# EAGLE design sensor (EAGLE 9.6.2)
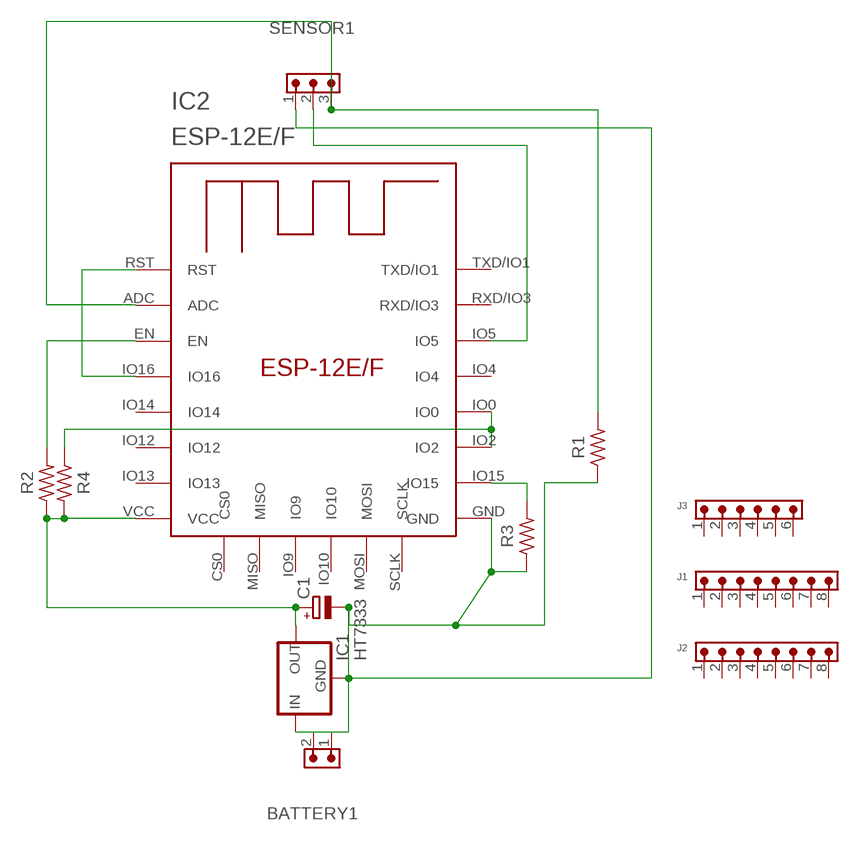
[diagram p0: schematic, sheet 1]

## Parts
BATTERY1  6130XX11121_61300211121  [61300211121]
C1  CPOL-EUE2-5  [E2-5]
IC1  HT7333  [SOT-89]
IC2  ESP-12E/F  [ESP-12E]
J1  6200XX11121_62000811121  [62000811121]
J2  6200XX11121_62000811121  [62000811121]
J3  6200XX11121_62000611121  [62000611121]
R1  R-US_AXIAL-7.2MM-PITCH  [RESAD724W46L381D178B]
R2  R-US_AXIAL-7.2MM-PITCH  [RESAD724W46L381D178B]
R3  R-US_AXIAL-7.2MM-PITCH  [RESAD724W46L381D178B]
R4  R-US_AXIAL-7.2MM-PITCH  [RESAD724W46L381D178B]
SENSOR1  6130XX11121_61300311121  [61300311121]

## Nets
N$1: IC2.IO5 SENSOR1.2
N$2: IC2.IO0 IC2.IO2 R4.1
N$3: IC2.ADC R1.2 SENSOR1.3
N$4: BATTERY1.1 IC1.3(IN) IC1.4(IN)
N$5: IC2.EN R2.2
N$6: IC2.IO16 IC2.RST
N$8: IC2.IO15 R3.2
N$9: BATTERY1.2 C1.- IC1.2(GND) IC2.GND R1.1 R3.1 SENSOR1.1
N$10: C1.+ IC1.1(OUT) IC2.VCC R2.1 R4.2
Unconnected: IC2.CS0 IC2.IO4 IC2.IO9 IC2.IO10 IC2.IO12 IC2.IO13 IC2.IO14 IC2.MISO IC2.MOSI IC2.RXD/IO3 IC2.SCLK IC2.TXD/IO1 J1.1 J1.2 J1.3 J1.4 J1.5 J1.6 J1.7 J1.8 J2.1 J2.2 J2.3 J2.4 J2.5 J2.6 J2.7 J2.8 J3.1 J3.2 J3.3 J3.4 J3.5 J3.6

## Library data of the parts
BATTERY1 = Wurth_Connectors_WR-PHD:6130XX11121_61300211121: WR-PHD 2.54 mm THT Pin Header ARTICLE PROPERTIES: Pins:1;​ 2;​ 3;​ 4;​ 5;​ 6;​ 7;​ 8;​ 9;​ 10;​ 12;​ 13;​ 14;​ 15;​ 16;​ 18;​ 20;​ 22;​ 24;​ 25;​ 32;​ 36;​ 40 KIND PROPERTIES: Pitch：2.54 mm Quality Class:3 as per CECC 75 301-802 Rows：Single Gender：Pin Header Type：Straight MATERIAL PROPERTIES: Insulator Material :PBT Insulator Flammability Rating:UL94 V-0 Contact Material:Copper Alloy Contact Plating:Gold Contact Type:Stamped GENERAL INFORMATION Operating Temperature:-40 up to +105 °C Compliance:RoHS ELECTRICAL PROPERTIES: Rated Current:3 A IR 1:3 A Withstanding Voltage:500 V (AC) Contact Resistance:20 mΩ RISO:1000 MΩ CERTIFICATION UL Approval:E323964 PACKAGING PROPERTIES Packaging:Bag <https://katalog.we-online.com/media/images/v2/o33211v209%20Family_BTB_PHD_6130xx11121.jpg> Details see: https://katalog.we-online.com/en/em/PHD_2_54_THT_PIN_HEADER_6130XX11121 Updated by Yingchun,Shan 2019-10-16 2019 (C) Würth Elektronik; DATASHEET-URL: https://katalog.we-online.com/em/datasheet/61300211121.pdf; GENDER: Pin Header; IR: 3A; MATES: WR-PHD 2.54mm Angled Socket Header /SMT Socket Header/Socket Header; PACKAGING: Bag; PART-NUMBER: 61300211121; PINS: 2; ROWS: Single; TYPE: Straight
C1 = rcl:CPOL-EU: POLARIZED CAPACITOR, European symbol; SPICEPREFIX: C
IC1 = holtek2:HT73*
IC2 = esp-12e-f:ESP-12E/F
J1 J2 = Wurth_Connectors_WR-PHD:6200XX11121_62000811121: WR-PHD 2.00 mm THT Pin Header ARTICLE PROPERTIES: Pins:2;​ 3;​ 4;​ 6;​ 8;​ 10;​ 20;​ 32 KIND PROPERTIES: Pitch：2 mm Quality Class:3 as per CECC 75 301-802 Rows：Single Gender：Pin Header Type：Straight MATERIAL PROPERTIES: Insulator Material :PA9T Insulator Flammability Rating:UL94 V-0 Contact Material:Copper Alloy Contact Plating:Gold Contact Type:Stamped GENERAL INFORMATION Operating Temperature:-40 up to +105 °C Compliance:Lead free / RoHS ELECTRICAL PROPERTIES: Rated Current:max.;​ 2 A IR 1:2A Withstanding Voltage:500 V (AC) Contact Resistance:20 mΩ RISO:1000 MΩ CERTIFICATION UL Approval:E323964 PACKAGING PROPERTIES Packaging:Bag Packaging Unit:1000;​ 500;​ 300;​ 200 <https://katalog.we-online.com/media/images/v2/o33219v209%20Family_WR-PHD_6200xx11121.jpg> Details see: https://katalog.we-online.com/en/em/PHD_2_00_THT_PIN_HEADER_6200XX11121 Updated by Yingchun,Shan 2019-10-24 2019 (C) Würth Elektronik; DATASHEET-URL: https://katalog.we-online.com/em/datasheet/62000811121.pdf; GENDER: Pin Header; IR: 2A; MATES: WR-PHD 2.0mm Socket Header; PACKAGING: Bag; PART-NUMBER: 62000811121; PINS: 8; ROWS: Single; TYPE: Straight
J3 = Wurth_Connectors_WR-PHD:6200XX11121_62000611121: WR-PHD 2.00 mm THT Pin Header ARTICLE PROPERTIES: Pins:2;​ 3;​ 4;​ 6;​ 8;​ 10;​ 20;​ 32 KIND PROPERTIES: Pitch：2 mm Quality Class:3 as per CECC 75 301-802 Rows：Single Gender：Pin Header Type：Straight MATERIAL PROPERTIES: Insulator Material :PA9T Insulator Flammability Rating:UL94 V-0 Contact Material:Copper Alloy Contact Plating:Gold Contact Type:Stamped GENERAL INFORMATION Operating Temperature:-40 up to +105 °C Compliance:Lead free / RoHS ELECTRICAL PROPERTIES: Rated Current:max.;​ 2 A IR 1:2A Withstanding Voltage:500 V (AC) Contact Resistance:20 mΩ RISO:1000 MΩ CERTIFICATION UL Approval:E323964 PACKAGING PROPERTIES Packaging:Bag Packaging Unit:1000;​ 500;​ 300;​ 200 <https://katalog.we-online.com/media/images/v2/o33219v209%20Family_WR-PHD_6200xx11121.jpg> Details see: https://katalog.we-online.com/en/em/PHD_2_00_THT_PIN_HEADER_6200XX11121 Updated by Yingchun,Shan 2019-10-24 2019 (C) Würth Elektronik; DATASHEET-URL: https://katalog.we-online.com/em/datasheet/62000611121.pdf; GENDER: Pin Header; IR: 2A; MATES: WR-PHD 2.0mm Socket Header; PACKAGING: Bag; PART-NUMBER: 62000611121; PINS: 6; ROWS: Single; TYPE: Straight
R1-R4 = Resistor:R-US: Resistor Fixed - ANSI; CATEGORY: Resistor; SUB-CATEGORY: Fixed
SENSOR1 = Wurth_Connectors_WR-PHD:6130XX11121_61300311121: WR-PHD 2.54 mm THT Pin Header ARTICLE PROPERTIES: Pins:1;​ 2;​ 3;​ 4;​ 5;​ 6;​ 7;​ 8;​ 9;​ 10;​ 12;​ 13;​ 14;​ 15;​ 16;​ 18;​ 20;​ 22;​ 24;​ 25;​ 32;​ 36;​ 40 KIND PROPERTIES: Pitch：2.54 mm Quality Class:3 as per CECC 75 301-802 Rows：Single Gender：Pin Header Type：Straight MATERIAL PROPERTIES: Insulator Material :PBT Insulator Flammability Rating:UL94 V-0 Contact Material:Copper Alloy Contact Plating:Gold Contact Type:Stamped GENERAL INFORMATION Operating Temperature:-40 up to +105 °C Compliance:RoHS ELECTRICAL PROPERTIES: Rated Current:3 A IR 1:3 A Withstanding Voltage:500 V (AC) Contact Resistance:20 mΩ RISO:1000 MΩ CERTIFICATION UL Approval:E323964 PACKAGING PROPERTIES Packaging:Bag <https://katalog.we-online.com/media/images/v2/o33211v209%20Family_BTB_PHD_6130xx11121.jpg> Details see: https://katalog.we-online.com/en/em/PHD_2_54_THT_PIN_HEADER_6130XX11121 Updated by Yingchun,Shan 2019-10-16 2019 (C) Würth Elektronik; DATASHEET-URL: https://katalog.we-online.com/em/datasheet/61300311121.pdf; GENDER: Pin Header; IR: 3A; MATES: WR-PHD 2.54mm Angled Socket Header /SMT Socket Header/Socket Header; PACKAGING: Bag; PART-NUMBER: 61300311121; PINS: 3; ROWS: Single; TYPE: Straight

## Board
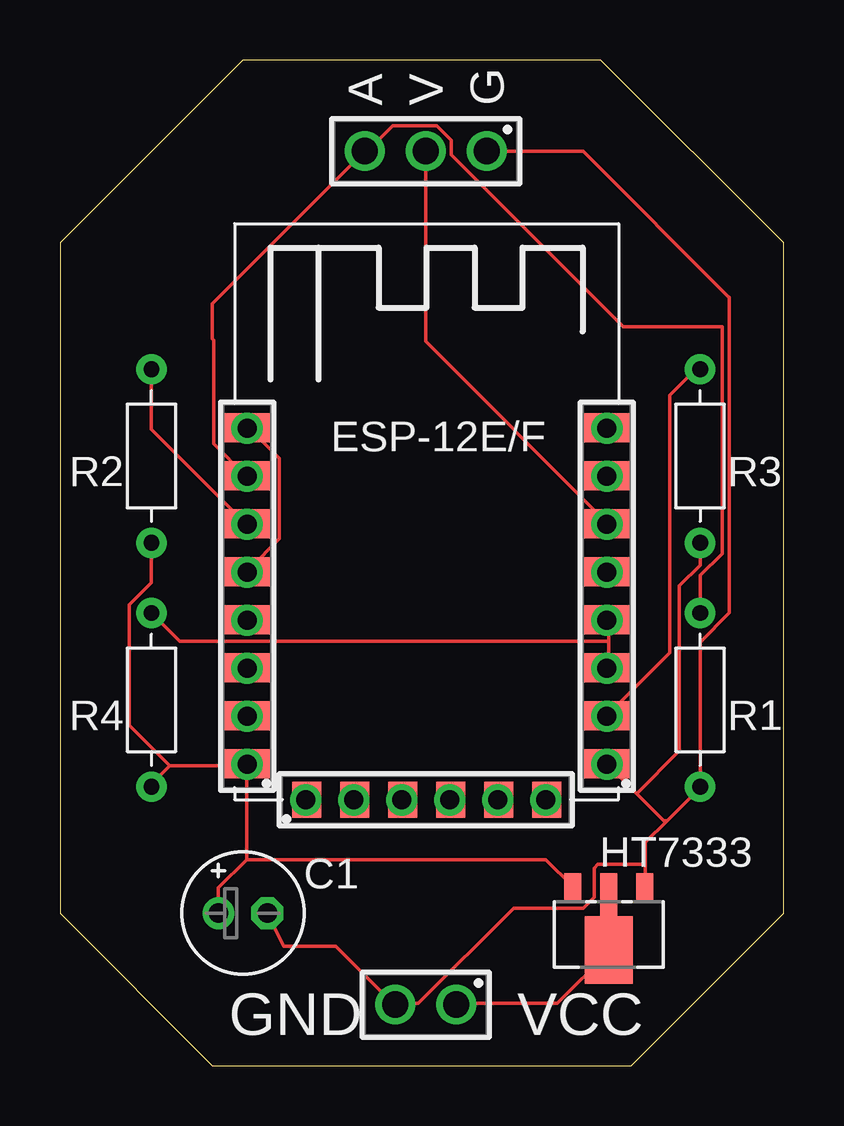
[diagram p1: board, top side]
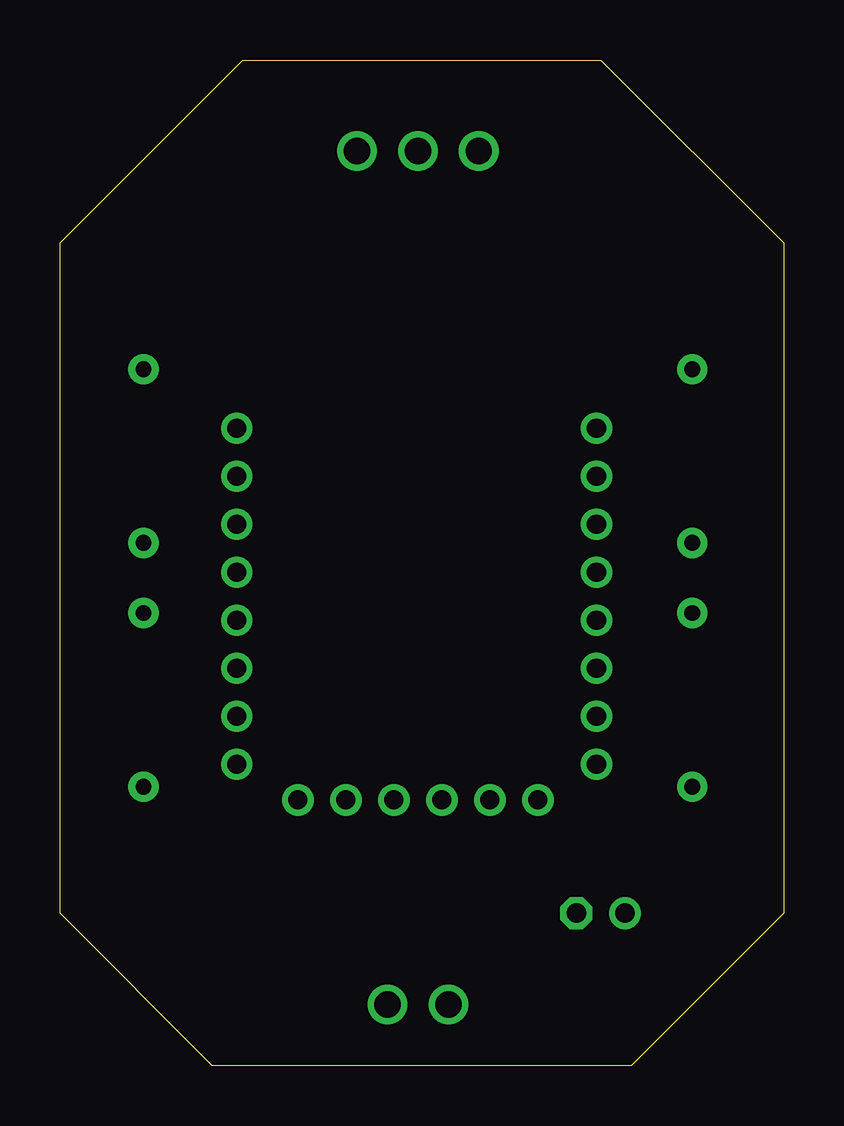
[diagram p2: board, bottom side, seen from below]

Size 30.15 x 41.9 mm. Coordinates in mm from the lower left corner, seen from the top.
Outline: 30.15,6.35 30.15,34.28 22.53,41.9 7.62,41.9 0,34.28 0,6.35 6.35,0 23.8,0 30.15,6.35
Copper layers (1*16): Top 0.035mm / dielectric 1.5mm / Bottom 0.035mm
Design rules "default": minimum track width 6mil, minimum drill 0.35mm, track to track 6mil, track to pad 6mil, pad to pad 6mil, via to via 6mil, smd to smd 6mil, copper to edge 40mil, drill to drill 6mil, minimum pad ring 10mil, minimum via ring 8mil, stop-mask expansion 4mil, vias tented up to drill 0mil, thermal gap 10mil

### Footprints (pad centres in the part's own frame; a part is rotated, then mirrored left to right if it is on the bottom)
61300211121 = drill 1.1: 1 -1.27,0; 2 1.27,0
E2-5 = drill 0.813 pad 1.27: + -1.016,0 | drill 0.813 pad 1.27 octagon: - 1.016,0
SOT-89 = smd 0.7 x 1.1: 1 1.5,-2.385; 2 -1.5,-2.385 | smd 0.7 x 1.8: 3 0,-2.035 | smd 2 x 2.8: 4 0,0.265
ESP-12E = smd 2 x 1.2: ADC -7.46,5.53; EN -7.46,3.53; GND 7.54,-6.47; IO0 7.54,-0.47; IO2 7.54,-2.47; IO4 7.54,1.53; IO5 7.54,3.53; IO12 -7.46,-2.47; IO13 -7.46,-4.47; IO14 -7.46,-0.47; IO15 7.54,-4.47; IO16 -7.46,1.53; RST -7.46,7.53; RXD/IO3 7.54,5.53; TXD/IO1 7.54,7.53; VCC -7.46,-6.47 | smd 1.2 x 1.5: CS0 -4.96,-7.97; IO9 -0.96,-7.97; IO10 1.04,-7.97; MISO -2.96,-7.97; MOSI 3.04,-7.97; SCLK 5.04,-7.97
62000811121 = drill 0.8: 1 -7,0; 2 -5,0; 3 -3,0; 4 -1,0; 5 1,0; 6 3,0; 7 5,0; 8 7,0
62000611121 = drill 0.8: 1 -5,0; 2 -3,0; 3 -1,0; 4 1,0; 5 3,0; 6 5,0
RESAD724W46L381D178B = drill 0.66 pad 1.26: 1 -3.62,0; 2 3.62,0
61300311121 = drill 1.1: 1 -2.54,0; 2 0,0; 3 2.54,0

### Placement (x,y rotation side)
BATTERY1  15.24,2.54 180 top
C1  7.62,6.35 0 top
IC1  22.86,5.08 180 top
IC2  15.24,19.05 0 top
J1  7.8,19.56 90 top
J2  22.78,19.56 90 top
J3  15.24,11.07 0 top
R1  26.67,15.24 90 top
R2  3.81,25.4 90 top
R3  26.67,25.4 90 top
R4  3.81,15.24 270 top
SENSOR1  15.24,38.1 180 top

### Tracks (layer width: path | path; a pad name or v marks a point on that pad's centre or on a via)
N$1
  Top 0.152: IC2.IO5 22.71,22.71 15.24,30.18 SENSOR1.2
N$2
  Top 0.152: 22.86,17.68 22.86,18.44 IC2.IO0 | 22.86,17.68 22.86,16.61 IC2.IO2 | 3.81,18.75 R4.1 5,17.68 22.86,17.68
N$3
  Top 0.152: IC2.ADC 7.73,24.58 6.4,25.91 6.4,30.23 6.35,30.28 6.35,31.75 SENSOR1.3 12.8,38.1 13.87,39.17 15.7,39.17 16.31,38.56 16.31,37.95 23.47,30.79 27.58,30.79 27.58,21.34 26.67,20.42 R1.2
N$4
  Top 0.152: IC1.3 IC1.4 22.86,4.72 20.73,2.59 16.61,2.59 BATTERY1.1
N$5
  Top 0.152: IC2.EN 7.75,22.58 3.81,26.52 R2.2
N$6
  Top 0.152: IC2.IO16 7.92,20.73 9.14,21.95 9.14,25.3 7.92,26.52 IC2.RST
N$8
  Top 0.152: 22.86,14.63 IC2.IO15 25.4,17.2 25.4,27.94 26.48,29.02 R3.2
N$9
  Top 0.152: C1.- 9.32,4.98 11.48,4.98 13.87,2.59 BATTERY1.2 14.02,2.59 14.94,2.59 18.9,6.55 21.79,6.55 22.25,7.01 22.25,8.23 22.4,8.38 24.38,8.38 | 24.38,8.38 24.38,9.3 25.3,10.21 | 24.38,8.38 24.38,7.47 IC1.2 | 25.3,10.21 26.67,11.58 R1.1 26.67,17.65 27.89,18.86 27.89,32 | 24.03,11.33 25.15,10.21 25.3,10.21 | 24.03,11.33 22.86,12.5 IC2.GND | 27.89,32.02 27.89,32 | R3.1 26.67,20.85 25.81,19.99 25.81,13.11 24.03,11.33 | SENSOR1.1 21.79,38.1 27.89,32
  Bottom 0.152: 26.67,11.73 R1.1
N$10
  Top 0.152: 4.57,12.5 7.77,12.5 | 4.57,12.5 3.81,11.73 R4.2 | R2.1 3.81,20.12 2.9,19.2 2.9,14.17 4.57,12.5 | IC1.1 20.24,8.59 7.77,8.59 | 7.77,8.59 7.77,12.5 | 7.77,12.5 IC2.VCC | C1.+ 6.6,7.42 7.77,8.59

### Text on the board
tNames: A | V | G | GND | VCC